# Altium project ECU V1.0 B.PrjPcb (part 4 of 9)

## Sheet 16_LPDDR.SchDoc
size A3; SheetNumber: 17; SheetTotal: 22
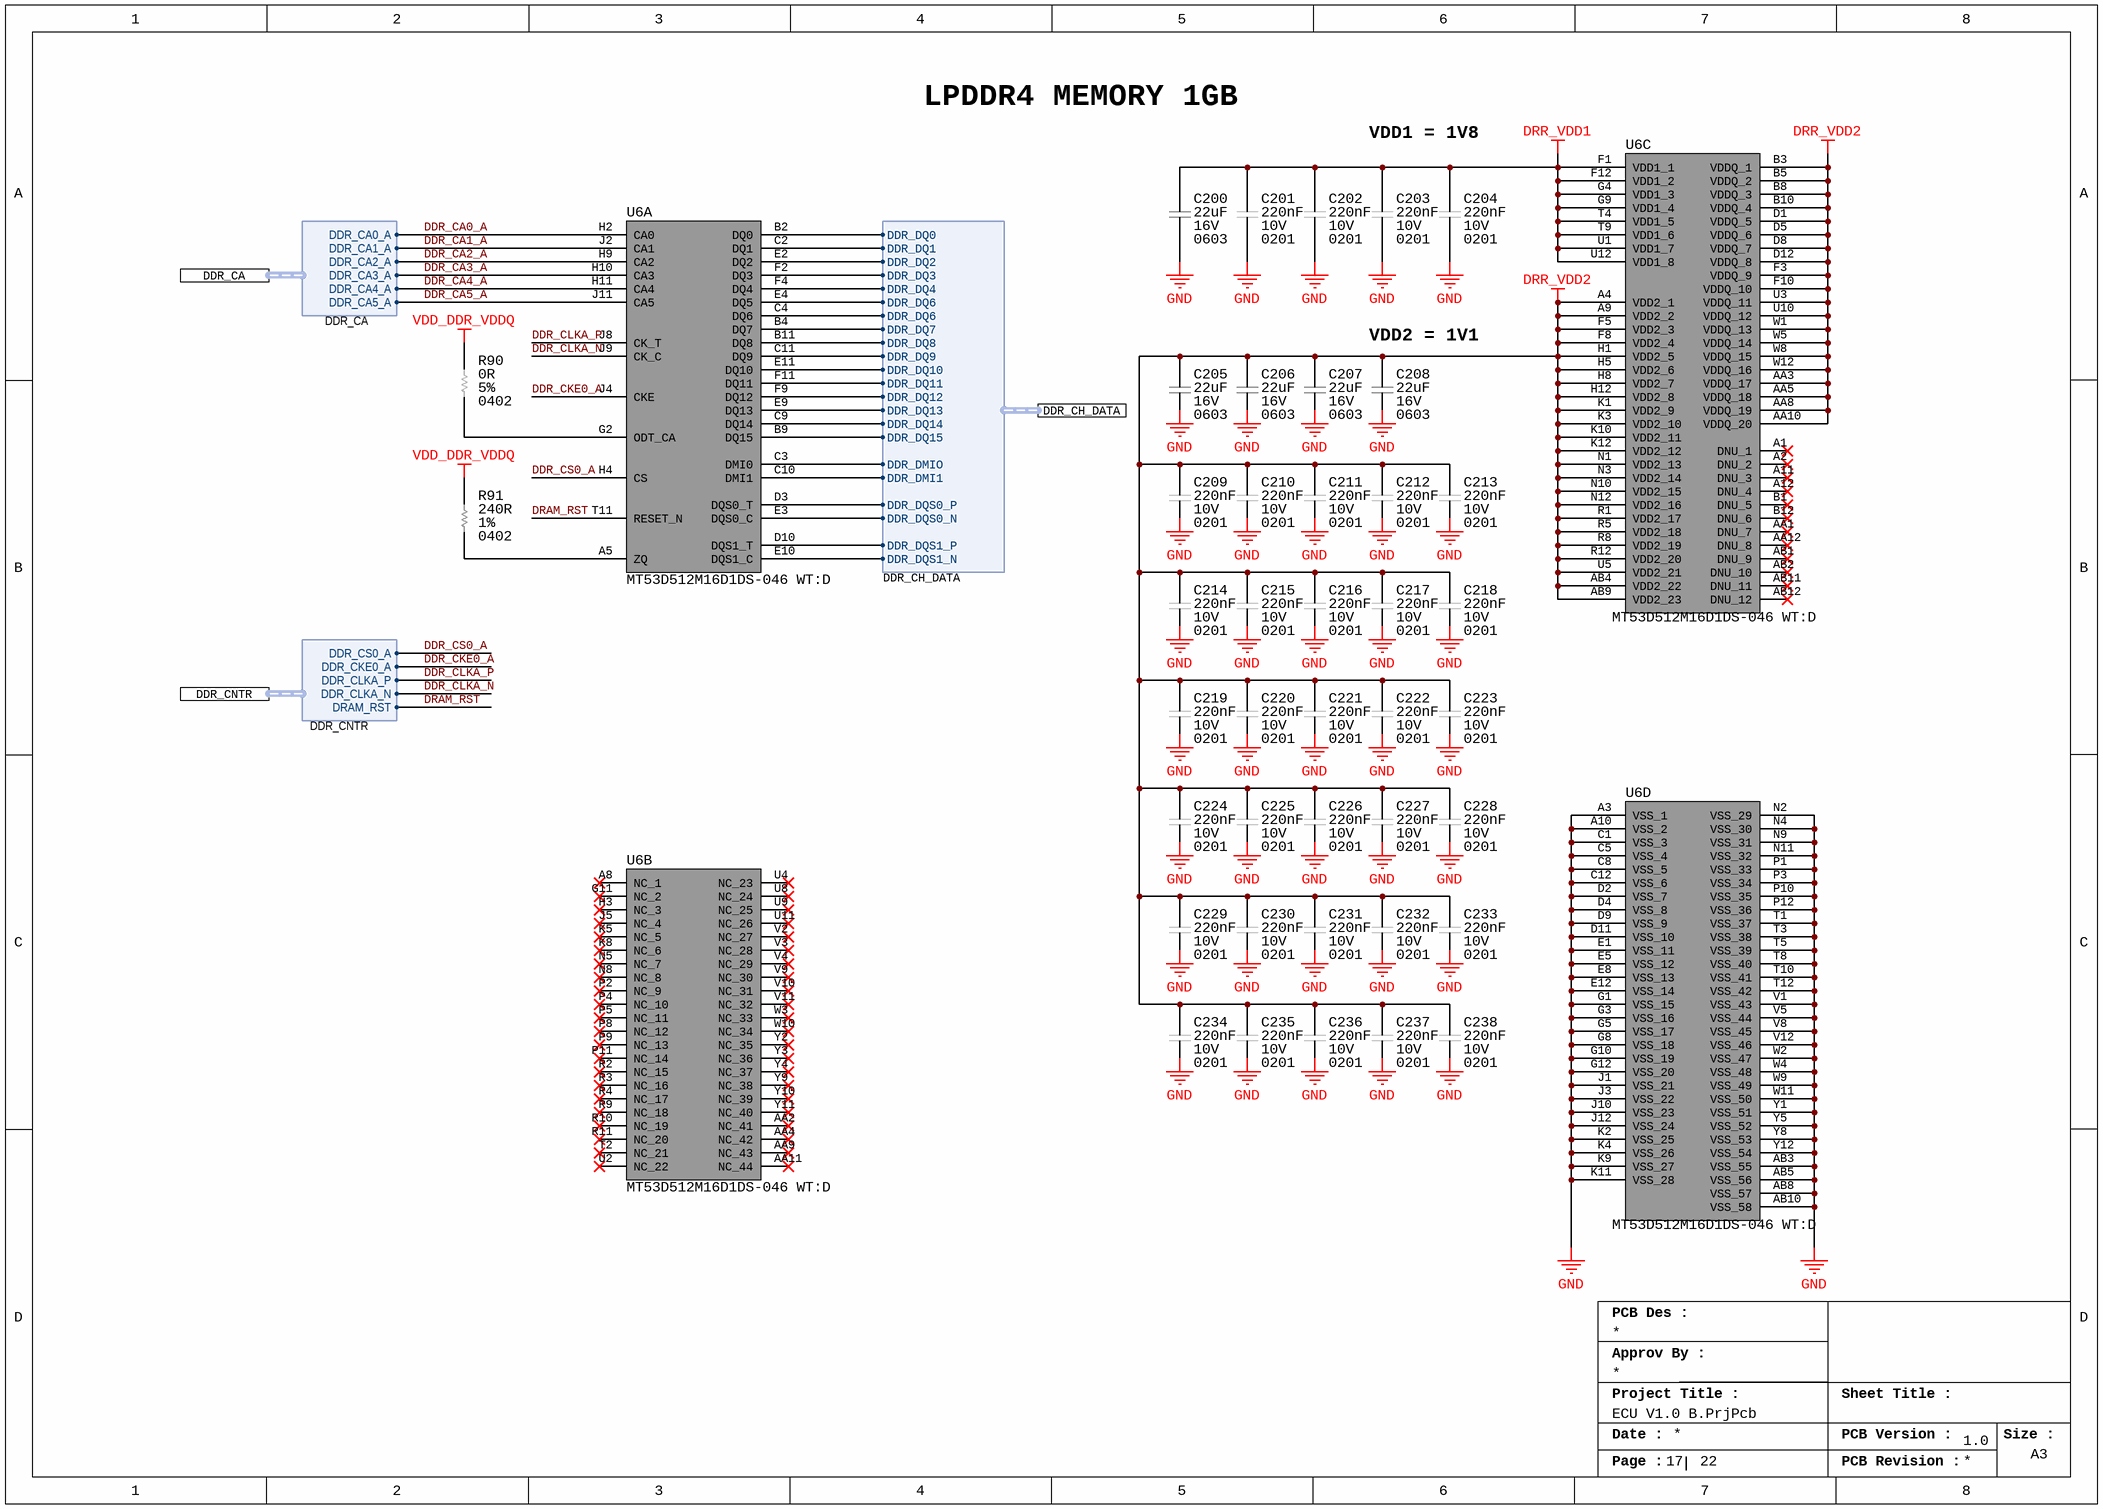
[diagram p4: 16_LPDDR.SchDoc]

### Parts
C200  Capacitance: 22uF  Voltage Rating: 16V  Case/Package: 0603  [CAP_0603_CAPC1608X08N]  (hidden comment: CL10A226MO7JZNC)
C201  Voltage Rating (DC): 10V  Capacitance: 220nF  Case/Package: 0201  [CAP_0201_CAPC0603X03N]  (hidden comment: LMK063BJ224MP-F)
C202  Voltage Rating (DC): 10V  Capacitance: 220nF  Case/Package: 0201  [CAP_0201_CAPC0603X03N]  (hidden comment: LMK063BJ224MP-F)
C203  Voltage Rating (DC): 10V  Capacitance: 220nF  Case/Package: 0201  [CAP_0201_CAPC0603X03N]  (hidden comment: LMK063BJ224MP-F)
C204  Voltage Rating (DC): 10V  Capacitance: 220nF  Case/Package: 0201  [CAP_0201_CAPC0603X03N]  (hidden comment: LMK063BJ224MP-F)
C205  Capacitance: 22uF  Voltage Rating: 16V  Case/Package: 0603  [CAP_0603_CAPC1608X08N]  (hidden comment: CL10A226MO7JZNC)
C206  Capacitance: 22uF  Voltage Rating: 16V  Case/Package: 0603  [CAP_0603_CAPC1608X08N]  (hidden comment: CL10A226MO7JZNC)
C207  Capacitance: 22uF  Voltage Rating: 16V  Case/Package: 0603  [CAP_0603_CAPC1608X08N]  (hidden comment: CL10A226MO7JZNC)
C208  Capacitance: 22uF  Voltage Rating: 16V  Case/Package: 0603  [CAP_0603_CAPC1608X08N]  (hidden comment: CL10A226MO7JZNC)
C209  Voltage Rating (DC): 10V  Capacitance: 220nF  Case/Package: 0201  [CAP_0201_CAPC0603X03N]  (hidden comment: LMK063BJ224MP-F)
C210  Voltage Rating (DC): 10V  Capacitance: 220nF  Case/Package: 0201  [CAP_0201_CAPC0603X03N]  (hidden comment: LMK063BJ224MP-F)
C211  Voltage Rating (DC): 10V  Capacitance: 220nF  Case/Package: 0201  [CAP_0201_CAPC0603X03N]  (hidden comment: LMK063BJ224MP-F)
C212  Voltage Rating (DC): 10V  Capacitance: 220nF  Case/Package: 0201  [CAP_0201_CAPC0603X03N]  (hidden comment: LMK063BJ224MP-F)
C213  Voltage Rating (DC): 10V  Capacitance: 220nF  Case/Package: 0201  [CAP_0201_CAPC0603X03N]  (hidden comment: LMK063BJ224MP-F)
C214  Voltage Rating (DC): 10V  Capacitance: 220nF  Case/Package: 0201  [CAP_0201_CAPC0603X03N]  (hidden comment: LMK063BJ224MP-F)
C215  Voltage Rating (DC): 10V  Capacitance: 220nF  Case/Package: 0201  [CAP_0201_CAPC0603X03N]  (hidden comment: LMK063BJ224MP-F)
C216  Voltage Rating (DC): 10V  Capacitance: 220nF  Case/Package: 0201  [CAP_0201_CAPC0603X03N]  (hidden comment: LMK063BJ224MP-F)
C217  Voltage Rating (DC): 10V  Capacitance: 220nF  Case/Package: 0201  [CAP_0201_CAPC0603X03N]  (hidden comment: LMK063BJ224MP-F)
C218  Voltage Rating (DC): 10V  Capacitance: 220nF  Case/Package: 0201  [CAP_0201_CAPC0603X03N]  (hidden comment: LMK063BJ224MP-F)
C219  Voltage Rating (DC): 10V  Capacitance: 220nF  Case/Package: 0201  [CAP_0201_CAPC0603X03N]  (hidden comment: LMK063BJ224MP-F)
C220  Voltage Rating (DC): 10V  Capacitance: 220nF  Case/Package: 0201  [CAP_0201_CAPC0603X03N]  (hidden comment: LMK063BJ224MP-F)
C221  Voltage Rating (DC): 10V  Capacitance: 220nF  Case/Package: 0201  [CAP_0201_CAPC0603X03N]  (hidden comment: LMK063BJ224MP-F)
C222  Voltage Rating (DC): 10V  Capacitance: 220nF  Case/Package: 0201  [CAP_0201_CAPC0603X03N]  (hidden comment: LMK063BJ224MP-F)
C223  Voltage Rating (DC): 10V  Capacitance: 220nF  Case/Package: 0201  [CAP_0201_CAPC0603X03N]  (hidden comment: LMK063BJ224MP-F)
C224  Voltage Rating (DC): 10V  Capacitance: 220nF  Case/Package: 0201  [CAP_0201_CAPC0603X03N]  (hidden comment: LMK063BJ224MP-F)
C225  Voltage Rating (DC): 10V  Capacitance: 220nF  Case/Package: 0201  [CAP_0201_CAPC0603X03N]  (hidden comment: LMK063BJ224MP-F)
C226  Voltage Rating (DC): 10V  Capacitance: 220nF  Case/Package: 0201  [CAP_0201_CAPC0603X03N]  (hidden comment: LMK063BJ224MP-F)
C227  Voltage Rating (DC): 10V  Capacitance: 220nF  Case/Package: 0201  [CAP_0201_CAPC0603X03N]  (hidden comment: LMK063BJ224MP-F)
C228  Voltage Rating (DC): 10V  Capacitance: 220nF  Case/Package: 0201  [CAP_0201_CAPC0603X03N]  (hidden comment: LMK063BJ224MP-F)
C229  Voltage Rating (DC): 10V  Capacitance: 220nF  Case/Package: 0201  [CAP_0201_CAPC0603X03N]  (hidden comment: LMK063BJ224MP-F)
C230  Voltage Rating (DC): 10V  Capacitance: 220nF  Case/Package: 0201  [CAP_0201_CAPC0603X03N]  (hidden comment: LMK063BJ224MP-F)
C231  Voltage Rating (DC): 10V  Capacitance: 220nF  Case/Package: 0201  [CAP_0201_CAPC0603X03N]  (hidden comment: LMK063BJ224MP-F)
C232  Voltage Rating (DC): 10V  Capacitance: 220nF  Case/Package: 0201  [CAP_0201_CAPC0603X03N]  (hidden comment: LMK063BJ224MP-F)
C233  Voltage Rating (DC): 10V  Capacitance: 220nF  Case/Package: 0201  [CAP_0201_CAPC0603X03N]  (hidden comment: LMK063BJ224MP-F)
C234  Voltage Rating (DC): 10V  Capacitance: 220nF  Case/Package: 0201  [CAP_0201_CAPC0603X03N]  (hidden comment: LMK063BJ224MP-F)
C235  Voltage Rating (DC): 10V  Capacitance: 220nF  Case/Package: 0201  [CAP_0201_CAPC0603X03N]  (hidden comment: LMK063BJ224MP-F)
C236  Voltage Rating (DC): 10V  Capacitance: 220nF  Case/Package: 0201  [CAP_0201_CAPC0603X03N]  (hidden comment: LMK063BJ224MP-F)
C237  Voltage Rating (DC): 10V  Capacitance: 220nF  Case/Package: 0201  [CAP_0201_CAPC0603X03N]  (hidden comment: LMK063BJ224MP-F)
C238  Voltage Rating (DC): 10V  Capacitance: 220nF  Case/Package: 0201  [CAP_0201_CAPC0603X03N]  (hidden comment: LMK063BJ224MP-F)
R90  Case Code (Imperial): 0402  Tolerance: 5%  Resistance: 0R  [RES_0402_RESC1005X04N]  (hidden comment: ERJ-2GE0R00X)
R91  Tolerance: 1%  Resistance: 240R  Case/Package: 0402  [RES_0402_RESC1005X04N]  (hidden comment: RC0402FR-07240RL)
U6  MT53D512M16D1DS-046 WT:D  [BGA200C65P12X22_1000X1450X80]  (parts A,B,C,D of 4)

### Ports
DDR_CA (harness DDR_CA), DDR_CH_DATA (harness DDR_CH_DATA), DDR_CNTR (harness DDR_CNTR)

### Harnesses
DDR_CH_DATA: DDR_DQ0, DDR_DQ1, DDR_DQ2, DDR_DQ3, DDR_DQ4, DDR_DQ6, DDR_DQ6, DDR_DQ7, DDR_DQS0_P, DDR_DQS0_N, DDR_DMIO, DDR_DQ8, DDR_DQ9, DDR_DQ10, DDR_DQ11, DDR_DQ12, DDR_DQ13, DDR_DQ14, DDR_DQ15, DDR_DQS1_P, DDR_DQS1_N, DDR_DMI1
DDR_CA: DDR_CA0_A, DDR_CA1_A, DDR_CA2_A, DDR_CA3_A, DDR_CA4_A, DDR_CA5_A
DDR_CNTR: DDR_CS0_A, DDR_CKE0_A, DDR_CLKA_P, DDR_CLKA_N, DRAM_RST

### Nets
DRR_VDD1: C200.2 C201.1 C202.1 C203.1 C204.1 U6.F1(VDD1_1) U6.F12(VDD1_2) U6.G4(VDD1_3) U6.G9(VDD1_4) U6.T4(VDD1_5) U6.T9(VDD1_6) U6.U1(VDD1_7) U6.U12(VDD1_8)
DRR_VDD2: C205.2 C206.2 C207.2 C208.2 C209.1 C210.1 C211.1 C212.1 C213.1 C214.1 C215.1 C216.1 C217.1 C218.1 C219.1 C220.1 C221.1 C222.1 C223.1 C224.1 C225.1 C226.1 C227.1 C228.1 C229.1 C230.1 C231.1 C232.1 C233.1 C234.1 C235.1 C236.1 C237.1 C238.1 U6.A4(VDD2_1) U6.A9(VDD2_2) U6.AA3(VDDQ_17) U6.AA5(VDDQ_18) U6.AA8(VDDQ_19) U6.AA10(VDDQ_20) U6.AB4(VDD2_22) U6.AB9(VDD2_23) U6.B3(VDDQ_1) U6.B5(VDDQ_2) U6.B8(VDDQ_3) U6.B10(VDDQ_4) U6.D1(VDDQ_5) U6.D5(VDDQ_6) U6.D8(VDDQ_7) U6.D12(VDDQ_8) U6.F3(VDDQ_9) U6.F5(VDD2_3) U6.F8(VDD2_4) U6.F10(VDDQ_10) U6.H1(VDD2_5) U6.H5(VDD2_6) U6.H8(VDD2_7) U6.H12(VDD2_8) U6.K1(VDD2_9) U6.K3(VDD2_10) U6.K10(VDD2_11) U6.K12(VDD2_12) U6.N1(VDD2_13) U6.N3(VDD2_14) U6.N10(VDD2_15) U6.N12(VDD2_16) U6.R1(VDD2_17) U6.R5(VDD2_18) U6.R8(VDD2_19) U6.R12(VDD2_20) U6.U3(VDDQ_11) U6.U5(VDD2_21) U6.U10(VDDQ_12) U6.W1(VDDQ_13) U6.W5(VDDQ_14) U6.W8(VDDQ_15) U6.W12(VDDQ_16)
GND: C200.1 C201.2 C202.2 C203.2 C204.2 C205.1 C206.1 C207.1 C208.1 C209.2 C210.2 C211.2 C212.2 C213.2 C214.2 C215.2 C216.2 C217.2 C218.2 C219.2 C220.2 C221.2 C222.2 C223.2 C224.2 C225.2 C226.2 C227.2 C228.2 C229.2 C230.2 C231.2 C232.2 C233.2 C234.2 C235.2 C236.2 C237.2 C238.2 U6.A3(VSS_1) U6.A10(VSS_2) U6.AB3(VSS_55) U6.AB5(VSS_56) U6.AB8(VSS_57) U6.AB10(VSS_58) U6.C1(VSS_3) U6.C5(VSS_4) U6.C8(VSS_5) U6.C12(VSS_6) U6.D2(VSS_7) U6.D4(VSS_8) U6.D9(VSS_9) U6.D11(VSS_10) U6.E1(VSS_11) U6.E5(VSS_12) U6.E8(VSS_13) U6.E12(VSS_14) U6.G1(VSS_15) U6.G3(VSS_16) U6.G5(VSS_17) U6.G8(VSS_18) U6.G10(VSS_19) U6.G12(VSS_20) U6.J1(VSS_21) U6.J3(VSS_22) U6.J10(VSS_23) U6.J12(VSS_24) U6.K2(VSS_25) U6.K4(VSS_26) U6.K9(VSS_27) U6.K11(VSS_28) U6.N2(VSS_29) U6.N4(VSS_30) U6.N9(VSS_31) U6.N11(VSS_32) U6.P1(VSS_33) U6.P3(VSS_34) U6.P10(VSS_35) U6.P12(VSS_36) U6.T1(VSS_37) U6.T3(VSS_38) U6.T5(VSS_39) U6.T8(VSS_40) U6.T10(VSS_41) U6.T12(VSS_42) U6.V1(VSS_43) U6.V5(VSS_44) U6.V8(VSS_45) U6.V12(VSS_46) U6.W2(VSS_47) U6.W4(VSS_48) U6.W9(VSS_49) U6.W11(VSS_50) U6.Y1(VSS_51) U6.Y5(VSS_52) U6.Y8(VSS_53) U6.Y12(VSS_54)
VDD_DDR_VDDQ: R90.2 R91.2
DDR_CA0_A: U6.H2(CA0) ; port DDR_CA.DDR_CA0_A
DDR_CA1_A: U6.J2(CA1) ; port DDR_CA.DDR_CA1_A
DDR_CA2_A: U6.H9(CA2) ; port DDR_CA.DDR_CA2_A
DDR_CA3_A: U6.H10(CA3) ; port DDR_CA.DDR_CA3_A
DDR_CA4_A: U6.H11(CA4) ; port DDR_CA.DDR_CA4_A
DDR_CA5_A: U6.J11(CA5) ; port DDR_CA.DDR_CA5_A
DDR_CKE0_A: U6.J4(CKE) ; port DDR_CNTR.DDR_CKE0_A
DDR_CLKA_N: U6.J9(CK_C) ; port DDR_CNTR.DDR_CLKA_N
DDR_CLKA_P: U6.J8(CK_T) ; port DDR_CNTR.DDR_CLKA_P
DDR_CS0_A: U6.H4(CS) ; port DDR_CNTR.DDR_CS0_A
DDR_DMI1: U6.C10(DMI1) ; port DDR_CH_DATA.DDR_DMI1
DDR_DMIO: U6.C3(DMI0) ; port DDR_CH_DATA.DDR_DMIO
DDR_DQ0: U6.B2(DQ0) ; port DDR_CH_DATA.DDR_DQ0
DDR_DQ1: U6.C2(DQ1) ; port DDR_CH_DATA.DDR_DQ1
DDR_DQ2: U6.E2(DQ2) ; port DDR_CH_DATA.DDR_DQ2
DDR_DQ3: U6.F2(DQ3) ; port DDR_CH_DATA.DDR_DQ3
DDR_DQ4: U6.F4(DQ4) ; port DDR_CH_DATA.DDR_DQ4
DDR_DQ5: U6.C4(DQ6) U6.E4(DQ5) ; port DDR_CH_DATA.DDR_DQ6
DDR_DQ7: U6.B4(DQ7) ; port DDR_CH_DATA.DDR_DQ7
DDR_DQ8: U6.B11(DQ8) ; port DDR_CH_DATA.DDR_DQ8
DDR_DQ9: U6.C11(DQ9) ; port DDR_CH_DATA.DDR_DQ9
DDR_DQ10: U6.E11(DQ10) ; port DDR_CH_DATA.DDR_DQ10
DDR_DQ11: U6.F11(DQ11) ; port DDR_CH_DATA.DDR_DQ11
DDR_DQ12: U6.F9(DQ12) ; port DDR_CH_DATA.DDR_DQ12
DDR_DQ13: U6.E9(DQ13) ; port DDR_CH_DATA.DDR_DQ13
DDR_DQ14: U6.C9(DQ14) ; port DDR_CH_DATA.DDR_DQ14
DDR_DQ15: U6.B9(DQ15) ; port DDR_CH_DATA.DDR_DQ15
DDR_DQS0_N: U6.E3(DQS0_C) ; port DDR_CH_DATA.DDR_DQS0_N
DDR_DQS0_P: U6.D3(DQS0_T) ; port DDR_CH_DATA.DDR_DQS0_P
DDR_DQS1_N: U6.E10(DQS1_C) ; port DDR_CH_DATA.DDR_DQS1_N
DDR_DQS1_P: U6.D10(DQS1_T) ; port DDR_CH_DATA.DDR_DQS1_P
DRAM_RST: U6.T11(RESET_N) ; port DDR_CNTR.DRAM_RST
NetR90_1: R90.1 U6.G2(ODT_CA)
NetR91_1: R91.1 U6.A5(ZQ)

Not connected (* = marked no-connect by the designer): U6 A1(DNU_1)* A2(DNU_2)* A8(NC_1)* A11(DNU_3)* A12(DNU_4)* AA1(DNU_7)* AA2(NC_41)* AA4(NC_42)* AA9(NC_43)* AA11(NC_44)* AA12(DNU_8)* AB1(DNU_9)* AB2(DNU_10)* AB11(DNU_11)* AB12(DNU_12)* B1(DNU_5)* B12(DNU_6)* G11(NC_2)* H3(NC_3)* J5(NC_4)* K5(NC_5)* K8(NC_6)* N5(NC_7)* N8(NC_8)* P2(NC_9)* P4(NC_10)* P5(NC_11)* P8(NC_12)* P9(NC_13)* P11(NC_14)* R2(NC_15)* R3(NC_16)* R4(NC_17)* R9(NC_18)* R10(NC_19)* R11(NC_20)* T2(NC_21)* U2(NC_22)* U4(NC_23)* U8(NC_24)* U9(NC_25)* U11(NC_26)* V2(NC_27)* V3(NC_28)* V4(NC_29)* V9(NC_30)* V10(NC_31)* V11(NC_32)* W3(NC_33)* W10(NC_34)* Y2(NC_35)* Y3(NC_36)* Y4(NC_37)* Y9(NC_38)* Y10(NC_39)* Y11(NC_40)*

### Notes on the sheet
- LPDDR4 MEMORY 1GB
- VDD1 = 1V8
- (near C208) VDD2 = 1V1
- PCB Des :
- Approv By :
- Project Title :
- Sheet Title :
- Date :
- PCB Version :
- Size :
- A3
- Page :
- PCB Revision :

### Library data of the parts
C200 C205-C208 = CAP_22UF_16V_X5R_0603: Cap Ceramic 22uF 16V X5R 20% Pad SMD 0603 85C T/R; Manufacturer: Samsung; Supplier 1: Digi-Key; Manufacturer Part Number: CL10A226MO7JZNC; RoHS: Yes; Category: Ceramic Capacitors; Stock 1: 1760065; Pricing 1: 1=0.59, 10=0.419, 50=0.3164, 100=0.2756, 500=0.20418, 1000=0.17355 (USD); Mount: Surface Mount; Case Code (Imperial): 0603; Case Code (Metric): 1608; Min Operating Temperature: -55°C; Max Operating Temperature: 85°C; Packaging: Cut Tape; Tolerance: 20%; Series: CL; RoHS Compliant: Yes; ComponentLink1URL: http://www.samsungsem.com/kr/support/product-search/mlcc/CL10A226MO7JZNC.jsp?src-supplier=Digi-Key; ComponentLink1Description: http://www.samsungsem.com/kr/support/product-search/mlcc/CL10A226MO7JZNC.jsp?src-supplier=Digi-Key; ComponentLink2URL: https://datasheet.octopart.com/CL10A226MO7JZNC-Samsung-Electro-Mechanics-datasheet-149156497.pdf?src-supplier=Future+Electronics; ComponentLink2Description: https://datasheet.octopart.com/CL10A226MO7JZNC-Samsung-Electro-Mechanics-datasheet-149156497.pdf?src-supplier=Future+Electronics; Supplier Part Number 1: 1276-7076-1-ND
C201-C204 C209-C238 = CAP_0.22UF_10V_X5R_0201: Multilayer Ceramic Capacitors (High dielectric type), 10V, 0.22 uF, ± 20 %, 0201, X5R, RoHS; Manufacturer: Taiyo Yuden; Material: 4241ConductorMaterial; Tolerance: 20%; Supplier 1: Digikey; Manufacturer Part Number: LMK063BJ224MP-F; RoHS: Yes; Category: Ceramic Capacitors; Stock 1: 6053224; Pricing 1: 1=0.12, 10=0.08, 50=0.0478, 100=0.0375, 500=0.02772, 1000=0.02295, 2500=0.02136, 5000=0.01954 (USD); Mount: Surface Mount; Case Code (Metric): 0603; Case Code (Imperial): 0201; Min Operating Temperature: -55°C; Max Operating Temperature: 85°C; Voltage Rating: 10V; Packaging: Tape and Reel; Package Quantity: 15000; Dielectric: X5R; Termination: SMD/SMT; Voltage: 10V; Series: M; Construction: Flat; Length: 0.6mm; Width: 0.3mm; Height: 0.3mm; Depth: 0.3mm; Radiation Hardening: No; Halogen Free: Halogen Free; RoHS Compliant: Yes; Reach SVHC Compliant: Unknown; ComponentLink1URL: https://datasheet.ciiva.com/134/lmk063bj224mp-f-ss-134995.pdf?src-supplier=Digikey; ComponentLink1Description: https://datasheet.ciiva.com/134/lmk063bj224mp-f-ss-134995.pdf?src-supplier=Digikey; ComponentLink2URL: https://datasheet.ciiva.com/11464/lmk063bj224mp-f-ss-11464053.pdf?src-supplier=Avnet; ComponentLink2Description: https://datasheet.ciiva.com/11464/lmk063bj224mp-f-ss-11464053.pdf?src-supplier=Avnet; ComponentLink3URL: https://datasheet.ciiva.com/15921/1589lmk063bj224mp-f-15921250.pdf?src-supplier=Onlinecomponents.com; ComponentLink3Description: https://datasheet.ciiva.com/15921/1589lmk063bj224mp-f-15921250.pdf?src-supplier=Onlinecomponents.com; ComponentLink4URL: https://datasheet.ciiva.com/26872/getdatasheetpartid-639019-26872592.pdf?src-supplier=Verical; ComponentLink4Description: https://datasheet.ciiva.com/26872/getdatasheetpartid-639019-26872592.pdf?src-supplier=Verical; ComponentLink5URL: https://datasheet.ciiva.com/30243/100lmk063bj224mp-f-30243150.pdf?src-supplier=Onlinecomponents.com; ComponentLink5Description: https://datasheet.ciiva.com/30243/100lmk063bj224mp-f-30243150.pdf?src-supplier=Onlinecomponents.com; ComponentLink6URL: https://datasheet.ciiva.com/28645/746258-28645141.pdf?src-supplier=Element14; ComponentLink6Description: https://datasheet.ciiva.com/28645/746258-28645141.pdf?src-supplier=Element14; ComponentLink7URL: https://datasheet.ciiva.com/5422/mlcc-all-e-541559-5422365.pdf?src-supplier=Mouser; ComponentLink7Description: https://datasheet.ciiva.com/5422/mlcc-all-e-541559-5422365.pdf?src-supplier=Mouser; Supplier Part Number 1: 587-2483-1-ND
R90 = RES_0R_5%_100mW_0402: SMD Chip Resistor, Jumper, 0 ohm, 100 mW, 0402 [1005 Metric], Thick Film, General Purpose; Manufacturer: Panasonic; Power Rating: 100mW; Voltage Rating: 50V; Temperature Coefficient: 600ppm/°C; Supplier 1: Mouser; Manufacturer Part Number: ERJ-2GE0R00X; RoHS: Yes; Category: Chip SMD Resistors; Stock 1: 10989354; Pricing 1: 1=0.1, 10=0.013, 50=0.013, 100=0.006, 1000=0.004, 2500=0.003, 10000=0.003 (USD); Mount: Surface Mount; Case/Package: 0402; Contact Plating: Tin; Case Code (Metric): 1005; Size Code: 0402; Min Operating Temperature: -55°C; Max Operating Temperature: 155°C; Resistor Type: Thick Film; Packaging: Cut Tape; Package Quantity: 10000; Number of Terminations: 2; Termination: SMD/SMT; Max Power Dissipation: 100mW; Voltage Rating (DC): 50V; Features: Automotive AEC-Q200; Series: ERJ; Construction: Rectangular; Technology: THICK FILM; Length: 1mm; Width: 0.5mm; Height: 0.35mm; Depth: 0.5mm; Ratings: AEC-Q200; Radiation Hardening: No; Reach SVHC Compliant: No; Military Standard: Not; Lead Free: Lead Free; RoHS Compliant: Yes; ComponentLink1URL: https://datasheet.ciiva.com/11821/0900766b80f806dd-11821176.pdf?src-supplier=Rs; ComponentLink1Description: https://datasheet.ciiva.com/11821/0900766b80f806dd-11821176.pdf?src-supplier=Rs; ComponentLink2URL: https://datasheet.ciiva.com/43460/1678796-43460347.pdf?src-supplier=Farnell; ComponentLink2Description: https://datasheet.ciiva.com/43460/1678796-43460347.pdf?src-supplier=Farnell; ComponentLink3URL: https://datasheet.ciiva.com/46389/1678796-46389518.pdf?src-supplier=Element14; ComponentLink3Description: https://datasheet.ciiva.com/46389/1678796-46389518.pdf?src-supplier=Element14; ComponentLink4URL: https://datasheet.ciiva.com/5959/1678796-5959692.pdf?src-supplier=Farnell; ComponentLink4Description: https://datasheet.ciiva.com/5959/1678796-5959692.pdf?src-supplier=Farnell; ComponentLink5URL: https://datasheet.ciiva.com/28695/1678796-28695758.pdf?src-supplier=Element14; ComponentLink5Description: https://datasheet.ciiva.com/28695/1678796-28695758.pdf?src-supplier=Element14; ComponentLink6URL: https://datasheet.ciiva.com/16783/70260739-16783734.pdf?src-supplier=Allied+Electronics; ComponentLink6Description: https://datasheet.ciiva.com/16783/70260739-16783734.pdf?src-supplier=Allied+Electronics; ComponentLink7URL: https://datasheet.ciiva.com/16778/70260739-16778335.pdf?src-supplier=Allied+Electronics; ComponentLink7Description: https://datasheet.ciiva.com/16778/70260739-16778335.pdf?src-supplier=Allied+Electronics; ComponentLink8URL: https://datasheet.ciiva.com/48531/aoa0000ce1-48531077.pdf?src-supplier=Avnet; ComponentLink8Description: https://datasheet.ciiva.com/48531/aoa0000ce1-48531077.pdf?src-supplier=Avnet; ComponentLink9URL: https://datasheet.ciiva.com/30097/4aoa0000ce1-30097116.pdf?src-supplier=Onlinecomponents.com; ComponentLink9Description: https://datasheet.ciiva.com/30097/4aoa0000ce1-30097116.pdf?src-supplier=Onlinecomponents.com; Supplier Part Number 1: 667-ERJ-2GE0R00X
R91 = RES_240R_1%_63mW_0402: SMD Chip Resistor, 240 Ohm, ± 1%, 63 mW, 0402 [1005 Metric], Thick Film, General Purpose; Manufacturer: Yageo; Power Rating: 63mW; Voltage Rating: 50V; Temperature Coefficient: 100ppm/°C; Supplier 1: Digi-Key; Manufacturer Part Number: RC0402FR-07240RL; RoHS: Yes; Category: Chip SMD Resistors; Stock 1: 1880273; Pricing 1: 1=0.1, 10=0.014, 50=0.0084, 100=0.007, 500=0.00464, 1000=0.00396, 5000=0.00282 (USD); Case Code (Metric): 1005; Case Code (Imperial): 0402; Size Code: 0402; Min Operating Temperature: -55°C; Max Operating Temperature: 155°C; Resistor Type: Thick Film; Packaging: Tape and Reel; Number of Terminations: 2; Termination: SMD/SMT; Max Power Dissipation: 63mW; Voltage Rating (DC): 50V; Features: Moisture Resistant; Series: RC; Construction: Rectangular; Resistance Tolerance: 1%; Length: 1mm; Depth: 0.5mm; RoHS Compliant: Yes; Military Standard: Not; Lead Free: Lead Free; Reach SVHC Compliant: Unknown; ComponentLink1URL: https://datasheet.ciiva.com/7849/1018594-7849915.pdf?src-supplier=Element14; ComponentLink1Description: https://datasheet.ciiva.com/7849/1018594-7849915.pdf?src-supplier=Element14; ComponentLink2URL: https://datasheet.ciiva.com/7849/1018594-7849916.pdf?src-supplier=Element14; ComponentLink2Description: https://datasheet.ciiva.com/7849/1018594-7849916.pdf?src-supplier=Element14; ComponentLink3URL: https://datasheet.ciiva.com/2519/pyu-r-int-thick-7-2519158.pdf?src-supplier=Digi-Key; ComponentLink3Description: https://datasheet.ciiva.com/2519/pyu-r-int-thick-7-2519158.pdf?src-supplier=Digi-Key; ComponentLink4URL: https://datasheet.ciiva.com/2519/pyu-r-int-thick-7-2519157.pdf?src-supplier=Digi-Key; ComponentLink4Description: https://datasheet.ciiva.com/2519/pyu-r-int-thick-7-2519157.pdf?src-supplier=Digi-Key; ComponentLink5URL: https://datasheet.ciiva.com/2519/pyu-r-int-thick-7-2519156.pdf?src-supplier=Digi-Key; ComponentLink5Description: https://datasheet.ciiva.com/2519/pyu-r-int-thick-7-2519156.pdf?src-supplier=Digi-Key; ComponentLink6URL: https://datasheet.ciiva.com/12669/pyu-rc0402-51-rohs-l-6-r-12669689.pdf?src-supplier=Mouser; ComponentLink6Description: https://datasheet.ciiva.com/12669/pyu-rc0402-51-rohs-l-6-r-12669689.pdf?src-supplier=Mouser; ComponentLink7URL: https://datasheet.ciiva.com/17419/pyu-rc0402-51-rohs-l-6-r-17419482.pdf?src-supplier=Future+Electronics; ComponentLink7Description: https://datasheet.ciiva.com/17419/pyu-rc0402-51-rohs-l-6-r-17419482.pdf?src-supplier=Future+Electronics; Supplier Part Number 1: 311-240LRCT-ND
U6 = IC_DRAM_8Gb_MT53D512M16D1DS-046 WT:D: Active Volatile ROHS3Compliant Automotive AEC-Q100 ic memory -30C~85C TC 8Gb 512M x 16 2.133GHz; Manufacturer: Micron Technology; Max Supply Current: 360mA; Max Supply Voltage: 1.17V; Min Supply Voltage: 1.06V; Number of Circuits: 1NUMBER; Operating Supply Voltage: 1.1V; Supplier 1: Digikey; Manufacturer Part Number: MT53D512M16D1DS-046 WT:D; RoHS: No; Category: Memory; Stock 1: 1200; Pricing 1: 1=9.81, 10=9.115, 25=8.834, 50=8.6224, 100=8.4121, 250=8.13712, 500=7.93238 (USD); Mount: Surface Mount; Number of Pins: 200; Min Operating Temperature: -30°C; Max Operating Temperature: 85°C; Memory Type: Volatile; Series: Automotive, AEC-Q100; Packaging: Tray; Memory Size: 8Gb; Frequency: 2.133GHz; Number of Ports: 1NUMBER; Length: 14.5mm; Width: 10mm; Height - Seated (Max): 800um; Terminal Pitch: 800um; Reach SVHC Compliant: 4188SVHC; ComponentLink1URL: https://datasheet.octopart.com/MT53D512M16D1DS-046-WT%3AD-Micron-datasheet-165827613.pdf?src-supplier=Farnell; ComponentLink1Description: https://datasheet.octopart.com/MT53D512M16D1DS-046-WT%3AD-Micron-datasheet-165827613.pdf?src-supplier=Farnell; Supplier Part Number 1: MT53D512M16D1DS-046WT:D-ND

## Sheet 02_PWR IN.SchDoc
size A3; SheetNumber: 3; SheetTotal: 22
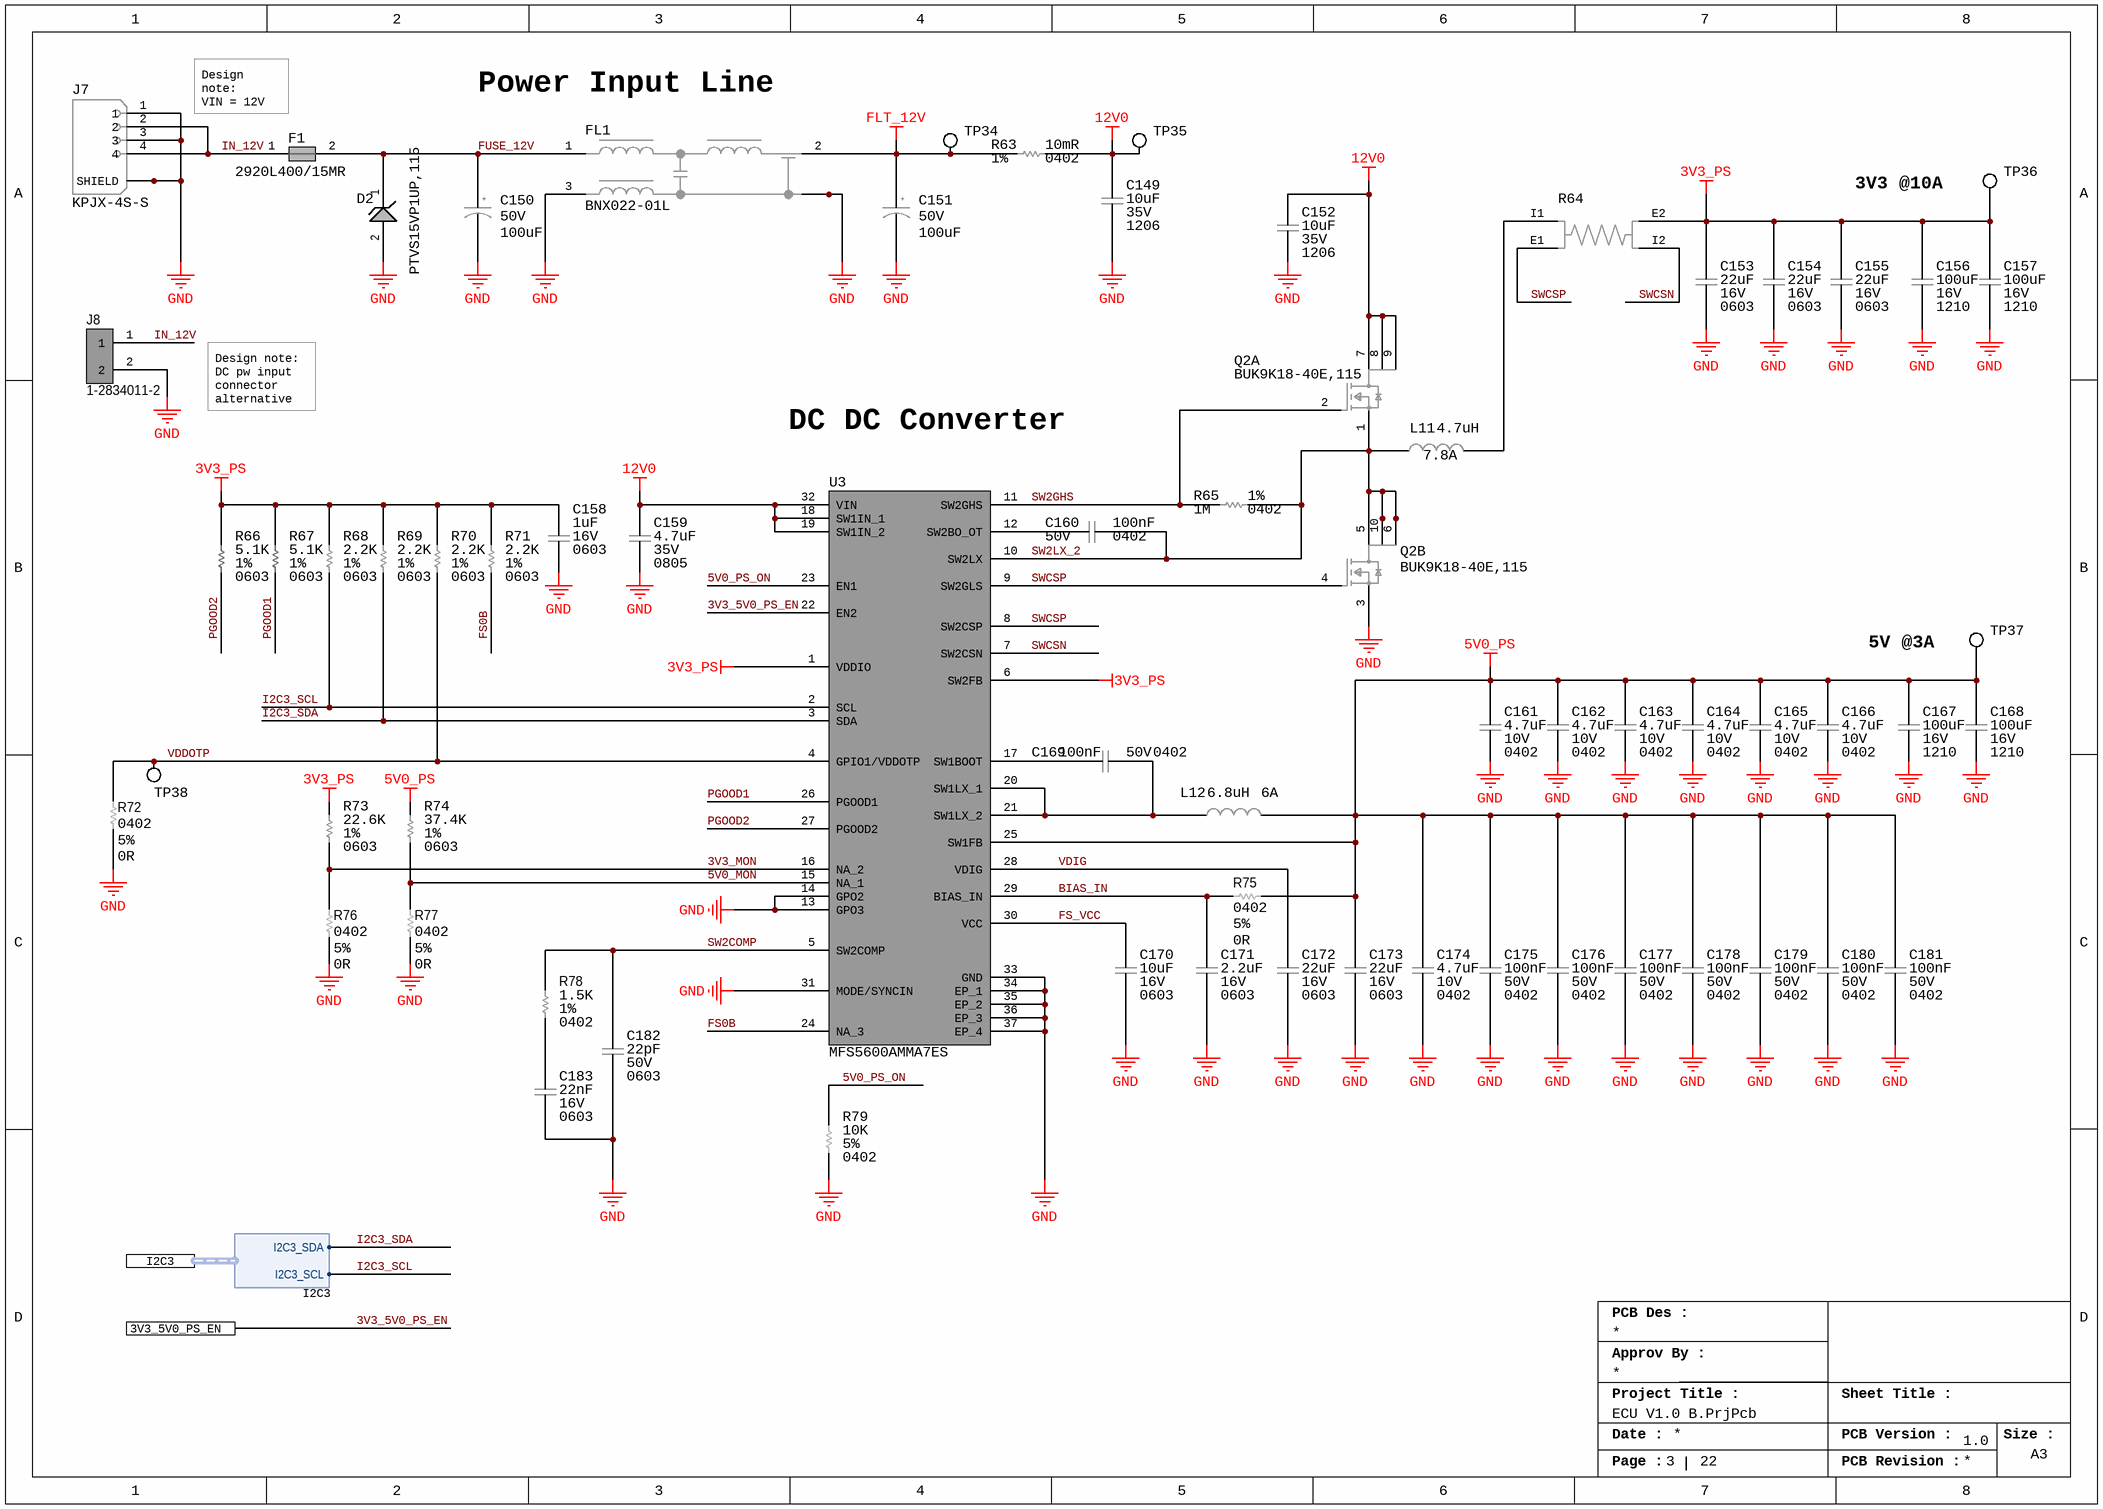
[diagram p5: 02_PWR IN.SchDoc]

### Parts
C149  Voltage Rating: 35V  Capacitance: 10uF  Case/Package: 1206  [CAP_1206_CAPC3216X16N]  (hidden comment: GRM319R6YA106KA12D)
C150  Voltage Rating (DC): 50V  Capacitance: 100uF  [CAP_POLA_UD(8X10)]  (hidden comment: UUD1H101MNL1GS)
C151  Voltage Rating (DC): 50V  Capacitance: 100uF  [CAP_POLA_UD(8X10)]  (hidden comment: UUD1H101MNL1GS)
C152  Voltage Rating: 35V  Capacitance: 10uF  Case/Package: 1206  [CAP_1206_CAPC3216X16N]  (hidden comment: GRM319R6YA106KA12D)
C153  Capacitance: 22uF  Voltage Rating: 16V  Case/Package: 0603  [CAP_0603_CAPC1608X08N]  (hidden comment: CL10A226MO7JZNC)
C154  Capacitance: 22uF  Voltage Rating: 16V  Case/Package: 0603  [CAP_0603_CAPC1608X08N]  (hidden comment: CL10A226MO7JZNC)
C155  Capacitance: 22uF  Voltage Rating: 16V  Case/Package: 0603  [CAP_0603_CAPC1608X08N]  (hidden comment: CL10A226MO7JZNC)
C156  Voltage Rating: 16V  Capacitance: 100uF  Case/Package: 1210  [CAP_1210_CAPC3225X270N]  (hidden comment: EMK325ABJ107MM-T)
C157  Voltage Rating: 16V  Capacitance: 100uF  Case/Package: 1210  [CAP_1210_CAPC3225X270N]  (hidden comment: EMK325ABJ107MM-T)
C158  Voltage Rating: 16V  Capacitance: 1uF  Case/Package: 0603  [CAP_0603_CAPC1608X08N]  (hidden comment: CL10A105KO8NNNC)
C159  Voltage Rating: 35V  Capacitance: 4.7uF  Case/Package: 0805  [CAP_0805_CAPC2012X12N]  (hidden comment: CL21A475KLCLQNC)
C160  Voltage Rating: 50V  Capacitance: 100nF  Case/Package: 0402  [CAP_0402_CAPC1005X05N]  (hidden comment: GRM155R71H104KE14D)
C161  Capacitance: 4.7uF  Voltage Rating: 10V  Case/Package: 0402  [CAP_0402_CAPC1005X05N]  (hidden comment: CL05A475KP5NRNC)
C162  Capacitance: 4.7uF  Voltage Rating: 10V  Case/Package: 0402  [CAP_0402_CAPC1005X05N]  (hidden comment: CL05A475KP5NRNC)
C163  Capacitance: 4.7uF  Voltage Rating: 10V  Case/Package: 0402  [CAP_0402_CAPC1005X05N]  (hidden comment: CL05A475KP5NRNC)
C164  Capacitance: 4.7uF  Voltage Rating: 10V  Case/Package: 0402  [CAP_0402_CAPC1005X05N]  (hidden comment: CL05A475KP5NRNC)
C165  Capacitance: 4.7uF  Voltage Rating: 10V  Case/Package: 0402  [CAP_0402_CAPC1005X05N]  (hidden comment: CL05A475KP5NRNC)
C166  Capacitance: 4.7uF  Voltage Rating: 10V  Case/Package: 0402  [CAP_0402_CAPC1005X05N]  (hidden comment: CL05A475KP5NRNC)
C167  Voltage Rating: 16V  Capacitance: 100uF  Case/Package: 1210  [CAP_1210_CAPC3225X270N]  (hidden comment: EMK325ABJ107MM-T)
C168  Voltage Rating: 16V  Capacitance: 100uF  Case/Package: 1210  [CAP_1210_CAPC3225X270N]  (hidden comment: EMK325ABJ107MM-T)
C169  Voltage Rating: 50V  Capacitance: 100nF  Case/Package: 0402  [CAP_0402_CAPC1005X05N]  (hidden comment: GRM155R71H104KE14D)
C170  Voltage Rating: 16V  Capacitance: 10uF  Case/Package: 0603  [CAP_0603_CAPC1608X08N]  (hidden comment: GRM188R61C106MAALD)
C171  Case/Package: 0603  Capacitance: 2.2uF  Voltage Rating: 16V  [CAP_0603_CAPC1608X08N]  (hidden comment: EMK107BB7225KA-T)
C172  Capacitance: 22uF  Voltage Rating: 16V  Case/Package: 0603  [CAP_0603_CAPC1608X08N]  (hidden comment: CL10A226MO7JZNC)
C173  Capacitance: 22uF  Voltage Rating: 16V  Case/Package: 0603  [CAP_0603_CAPC1608X08N]  (hidden comment: CL10A226MO7JZNC)
C174  Capacitance: 4.7uF  Voltage Rating: 10V  Case/Package: 0402  [CAP_0402_CAPC1005X05N]  (hidden comment: CL05A475KP5NRNC)
C175  Voltage Rating: 50V  Capacitance: 100nF  Case/Package: 0402  [CAP_0402_CAPC1005X05N]  (hidden comment: GRM155R71H104KE14D)
C176  Voltage Rating: 50V  Capacitance: 100nF  Case/Package: 0402  [CAP_0402_CAPC1005X05N]  (hidden comment: GRM155R71H104KE14D)
C177  Voltage Rating: 50V  Capacitance: 100nF  Case/Package: 0402  [CAP_0402_CAPC1005X05N]  (hidden comment: GRM155R71H104KE14D)
C178  Voltage Rating: 50V  Capacitance: 100nF  Case/Package: 0402  [CAP_0402_CAPC1005X05N]  (hidden comment: GRM155R71H104KE14D)
C179  Voltage Rating: 50V  Capacitance: 100nF  Case/Package: 0402  [CAP_0402_CAPC1005X05N]  (hidden comment: GRM155R71H104KE14D)
C180  Voltage Rating: 50V  Capacitance: 100nF  Case/Package: 0402  [CAP_0402_CAPC1005X05N]  (hidden comment: GRM155R71H104KE14D)
C181  Voltage Rating: 50V  Capacitance: 100nF  Case/Package: 0402  [CAP_0402_CAPC1005X05N]  (hidden comment: GRM155R71H104KE14D)
C182  Voltage Rating (DC): 50V  Capacitance: 22pF  Case/Package: 0603  [CAP_0603_CAPC1608X08N]  (hidden comment: C0603C220J5GACTU)
C183  Voltage Rating (DC): 16V  Capacitance: 22nF  Case/Package: 0603  [CAP_0603_CAPC1608X08N]  (hidden comment: C0603C223K4RACTU)
D2  PTVS15VP1UP,115  [PMEG3050EP115]
F1  2920L400/15MR  [2920L07560MR]
FL1  BNX022-01L  [FILTER_BNX022-01L]
J7  KPJX-4S-S  [CONN_DC_KYCON_KPJX-4S-S]
J8  1-2834011-2  [CONN_TBLOCK_128340112]
L11  Current Rating: 7.8A  Inductance: 4.7uH  [SPM7054VT]  (hidden comment: SPM7054VT-4R7M-D)
L12  Max DC Current: 6A  Inductance: 6.8uH  [WE-LHMI_104048]  (hidden comment: 74437368068)
Q2  BUK9K18-40E,115  [BUK9K1840E115]  (parts A,B of 2)
R63  Tolerance: 1%  Resistance: 10mR  Case/Package: 0402  [RES_0603_RESC1608X04N]  (hidden comment: ERJ-2LWFR010X)
R64  WSK2512R0100FEA  [RES_WSK2512R0100FEA]  (value not drawn)
R65  Resistance: 1M  Tolerance: 1%  Case/Package: 0402  [RES_0402_RESC1005X04N]  (hidden comment: CR0402-FX-1004GLF)
R66  Tolerance: 1%  Resistance: 5.1K  Case/Package: 0603  [RES_0603_RESC1608X04N]  (hidden comment: RC0603FR-075K1L)
R67  Tolerance: 1%  Resistance: 5.1K  Case/Package: 0603  [RES_0603_RESC1608X04N]  (hidden comment: RC0603FR-075K1L)
R68  Tolerance: 1%  Resistance: 2.2K  Case/Package: 0603  [RES_0603_RESC1608X04N]  (hidden comment: RC0603FR-072K2L)
R69  Tolerance: 1%  Resistance: 2.2K  Case/Package: 0603  [RES_0603_RESC1608X04N]  (hidden comment: RC0603FR-072K2L)
R70  Tolerance: 1%  Resistance: 2.2K  Case/Package: 0603  [RES_0603_RESC1608X04N]  (hidden comment: RC0603FR-072K2L)
R71  Tolerance: 1%  Resistance: 2.2K  Case/Package: 0603  [RES_0603_RESC1608X04N]  (hidden comment: RC0603FR-072K2L)
R72  Case Code (Imperial): 0402  Tolerance: 5%  Resistance: 0R  [RES_0402_RESC1005X04N]  (hidden comment: ERJ-2GE0R00X)
R73  Tolerance: 1%  Resistance: 22.6K  Case/Package: 0603  [RES_0603_RESC1608X04N]  (hidden comment: AC0603FR-0722K6L)
R74  Tolerance: 1%  Resistance: 37.4K  Case/Package: 0603  [RES_0603_RESC1608X04N]  (hidden comment: RC0603FR-0737K4L)
R75  Case Code (Imperial): 0402  Tolerance: 5%  Resistance: 0R  [RES_0402_RESC1005X04N]  (hidden comment: ERJ-2GE0R00X)
R76  Case Code (Imperial): 0402  Tolerance: 5%  Resistance: 0R  [RES_0402_RESC1005X04N]  (hidden comment: ERJ-2GE0R00X)
R77  Case Code (Imperial): 0402  Tolerance: 5%  Resistance: 0R  [RES_0402_RESC1005X04N]  (hidden comment: ERJ-2GE0R00X)
R78  Resistance: 1.5K  Tolerance: 1%  Case/Package: 0402  [RES_0402_RESC1005X04N]  (hidden comment: CR0402-FX-1501GLF)
R79  Tolerance: 5%  Resistance: 10K  Case/Package: 0402  [RES_0402_RESC1005X04N]  (hidden comment: ERJ-2GEJ103X)
TP34  NO COMPONENT  [TP_PAD_0.5MM_SMD_ROUND]  (value not drawn)  (no BOM)
TP35  NO COMPONENT  [TP_PAD_0.5MM_SMD_ROUND]  (value not drawn)  (no BOM)
TP36  NO COMPONENT  [TP_PAD_0.5MM_SMD_ROUND]  (value not drawn)  (no BOM)
TP37  NO COMPONENT  [TP_PAD_0.5MM_SMD_ROUND]  (value not drawn)  (no BOM)
TP38  NO COMPONENT  [TP_PAD_0.5MM_SMD_ROUND]  (value not drawn)  (no BOM)
U3  MFS5600AMMA7ES  [MFS5600AMMA7ES]

### Ports
3V3_5V0_PS_EN, I2C3 (harness I2C3)

### Harnesses
I2C3: I2C3_SDA, I2C3_SCL

### Nets
3V3_PS: C153.2 C154.2 C155.2 C156.2 C157.2 C158.2 R64.E2 R66.2 R67.2 R68.2 R69.2 R70.2 R71.2 R73.2 TP36.1 U3.1(VDDIO) U3.6(SW2FB)
5V0_PS: C161.2 C162.2 C163.2 C164.2 C165.2 C166.2 C167.2 C168.2 C173.2 C174.2 C175.2 C176.2 C177.2 C178.2 C179.2 C180.2 C181.2 L12.2 R74.2 R75.1 TP37.1 U3.25(SW1FB)
12V0: C149.2 C152.2 C159.2 Q2.7(D1_1) Q2.8(D1_2) Q2.9(D1_3) R63.2 TP35.1 U3.18(SW1IN_1) U3.19(SW1IN_2) U3.32(VIN)
FLT_12V: C151.1 FL1.2(CB) R63.1 TP34.1
GND: C149.1 C150.2 C151.2 C152.1 C153.1 C154.1 C155.1 C156.1 C157.1 C158.1 C159.1 C161.1 C162.1 C163.1 C164.1 C165.1 C166.1 C167.1 C168.1 C170.1 C171.1 C172.1 C173.1 C174.1 C175.1 C176.1 C177.1 C178.1 C179.1 C180.1 C181.1 C182.1 C183.1 D2.2(A) FL1.3(PSG) FL1.4(CG) FL1.5(CG) FL1.6(CG) J7.1 J7.3 J7.S1(SHIELD) J7.S2(SHIELD) J7.S3(SHIELD) J8.2 Q2.3(S2) R72.1 R76.1 R77.1 R79.2 U3.13(GPO3) U3.14(GPO2) U3.31(MODE/SYNCIN) U3.33(GND) U3.34(EP_1) U3.35(EP_2) U3.36(EP_3) U3.37(EP_4)
3V3_5V0_PS_EN: U3.22(EN2) ; port 3V3_5V0_PS_EN
3V3_MON: R73.1 R76.2 U3.16(NA_2)
5V0_MON: R74.1 R77.2 U3.15(NA_1)
5V0_PS_ON: R79.1 U3.23(EN1)
BIAS_IN: C171.2 R75.2 U3.29(BIAS_IN)
FS0B: R71.1 U3.24(NA_3)
FS_VCC: C170.2 U3.30(VCC)
FUSE_12V: C150.1 D2.1(K) F1.2 FL1.1(B)
I2C3_SCL: R68.1 U3.2(SCL) ; port I2C3.I2C3_SCL
I2C3_SDA: R69.1 U3.3(SDA) ; port I2C3.I2C3_SDA
IN_12V: F1.1 J7.2 J7.4 J8.1
PGOOD1: R67.1 U3.26(PGOOD1)
PGOOD2: R66.1 U3.27(PGOOD2)
SW2COMP: C182.2 R78.2 U3.5(SW2COMP)
SW2GHS: Q2.2(G1) R65.1 U3.11(SW2GHS)
SW2LX_2: C160.1 L11.1 Q2.1(S1) Q2.5(D2_1) Q2.6(D2_2) Q2.10(D2_3) R65.2 U3.10(SW2LX)
SWCSN: R64.I2 U3.7(SW2CSN)
SWCSP: Q2.4(G2) R64.E1 U3.8(SW2CSP) U3.9(SW2GLS)
VDDOTP: R70.1 R72.2 TP38.1 U3.4(GPIO1/VDDOTP)
VDIG: C172.2 U3.28(VDIG)
NetC160_2: C160.2 U3.12(SW2BO_OT)
NetC169_1: C169.1 U3.17(SW1BOOT)
NetC169_2: C169.2 L12.1 U3.20(SW1LX_1) U3.21(SW1LX_2)
NetC183_2: C183.2 R78.1
NetL11_2: L11.2 R64.I1

### Notes on the sheet
- (near F1) Design note:
  VIN = 12V
  Imax = 8A
- Power Input Line
- 3V3 @10A
- Design note:
  DC pw input connector alternative
- DC DC Converter
- 5V @3A
- PCB Des :
- Approv By :
- Project Title :
- Sheet Title :
- Date :
- PCB Version :
- Size :
- A3
- Page :
- PCB Revision :
- (in symbol CAP_100UF_50V_POL) +